# EAGLE design PCB (EAGLE 6.3)
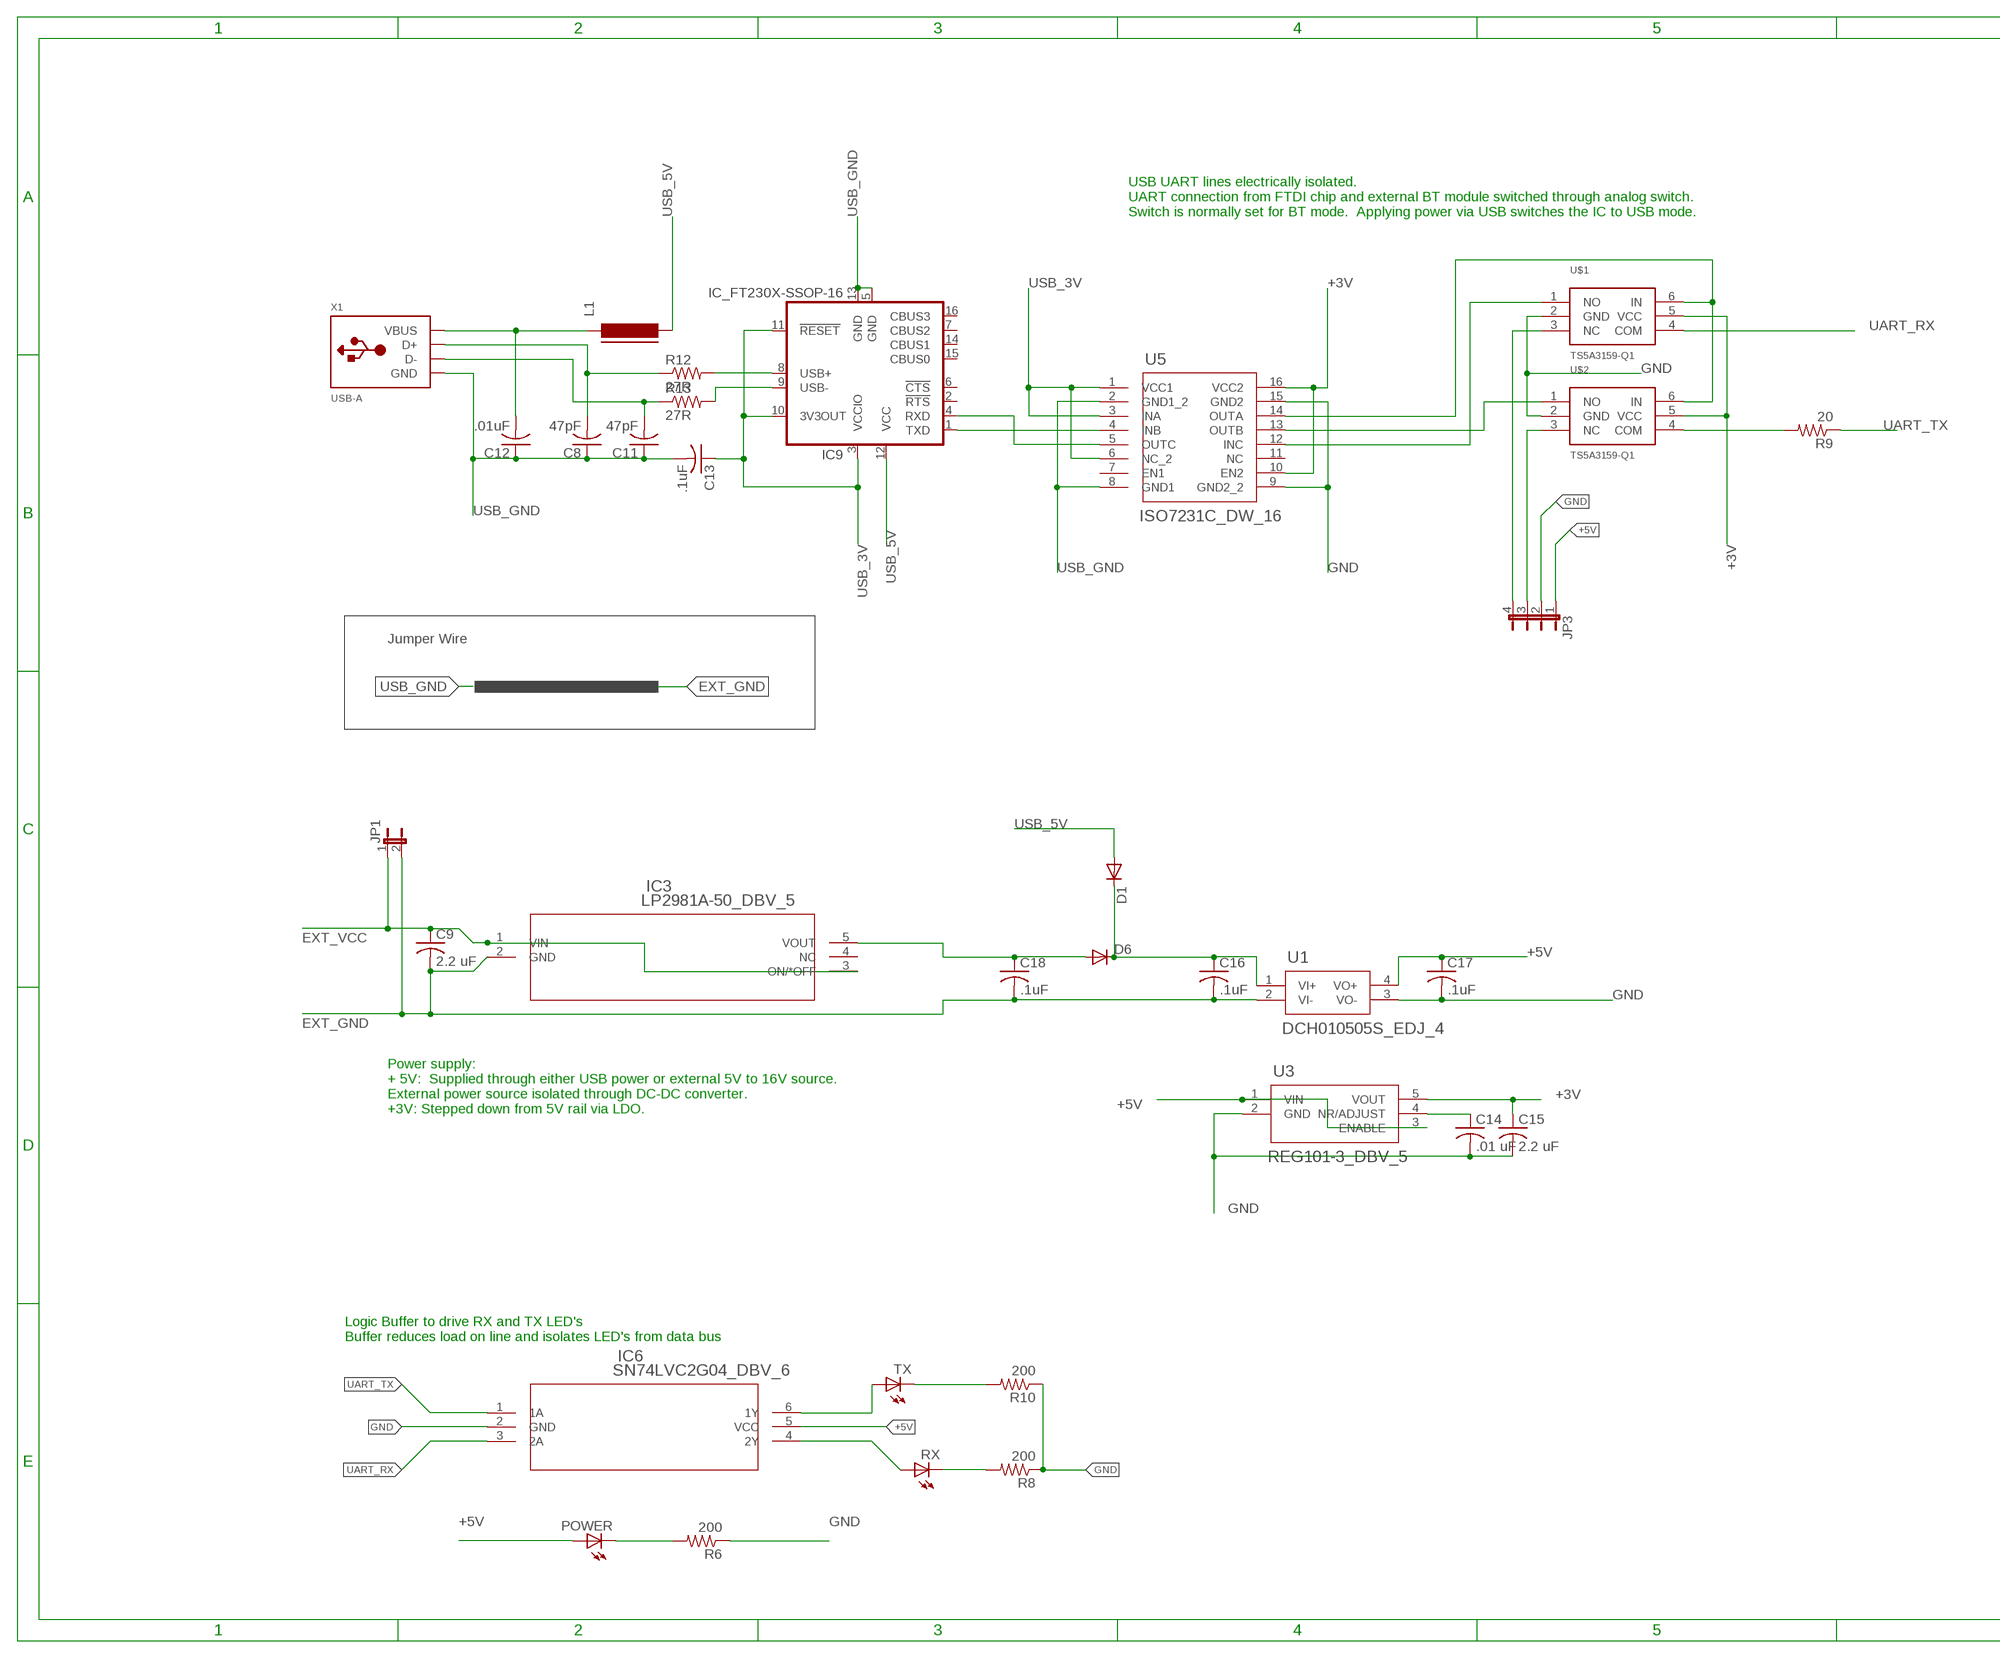
[diagram p0: schematic, sheet 1, part 1 of 2]
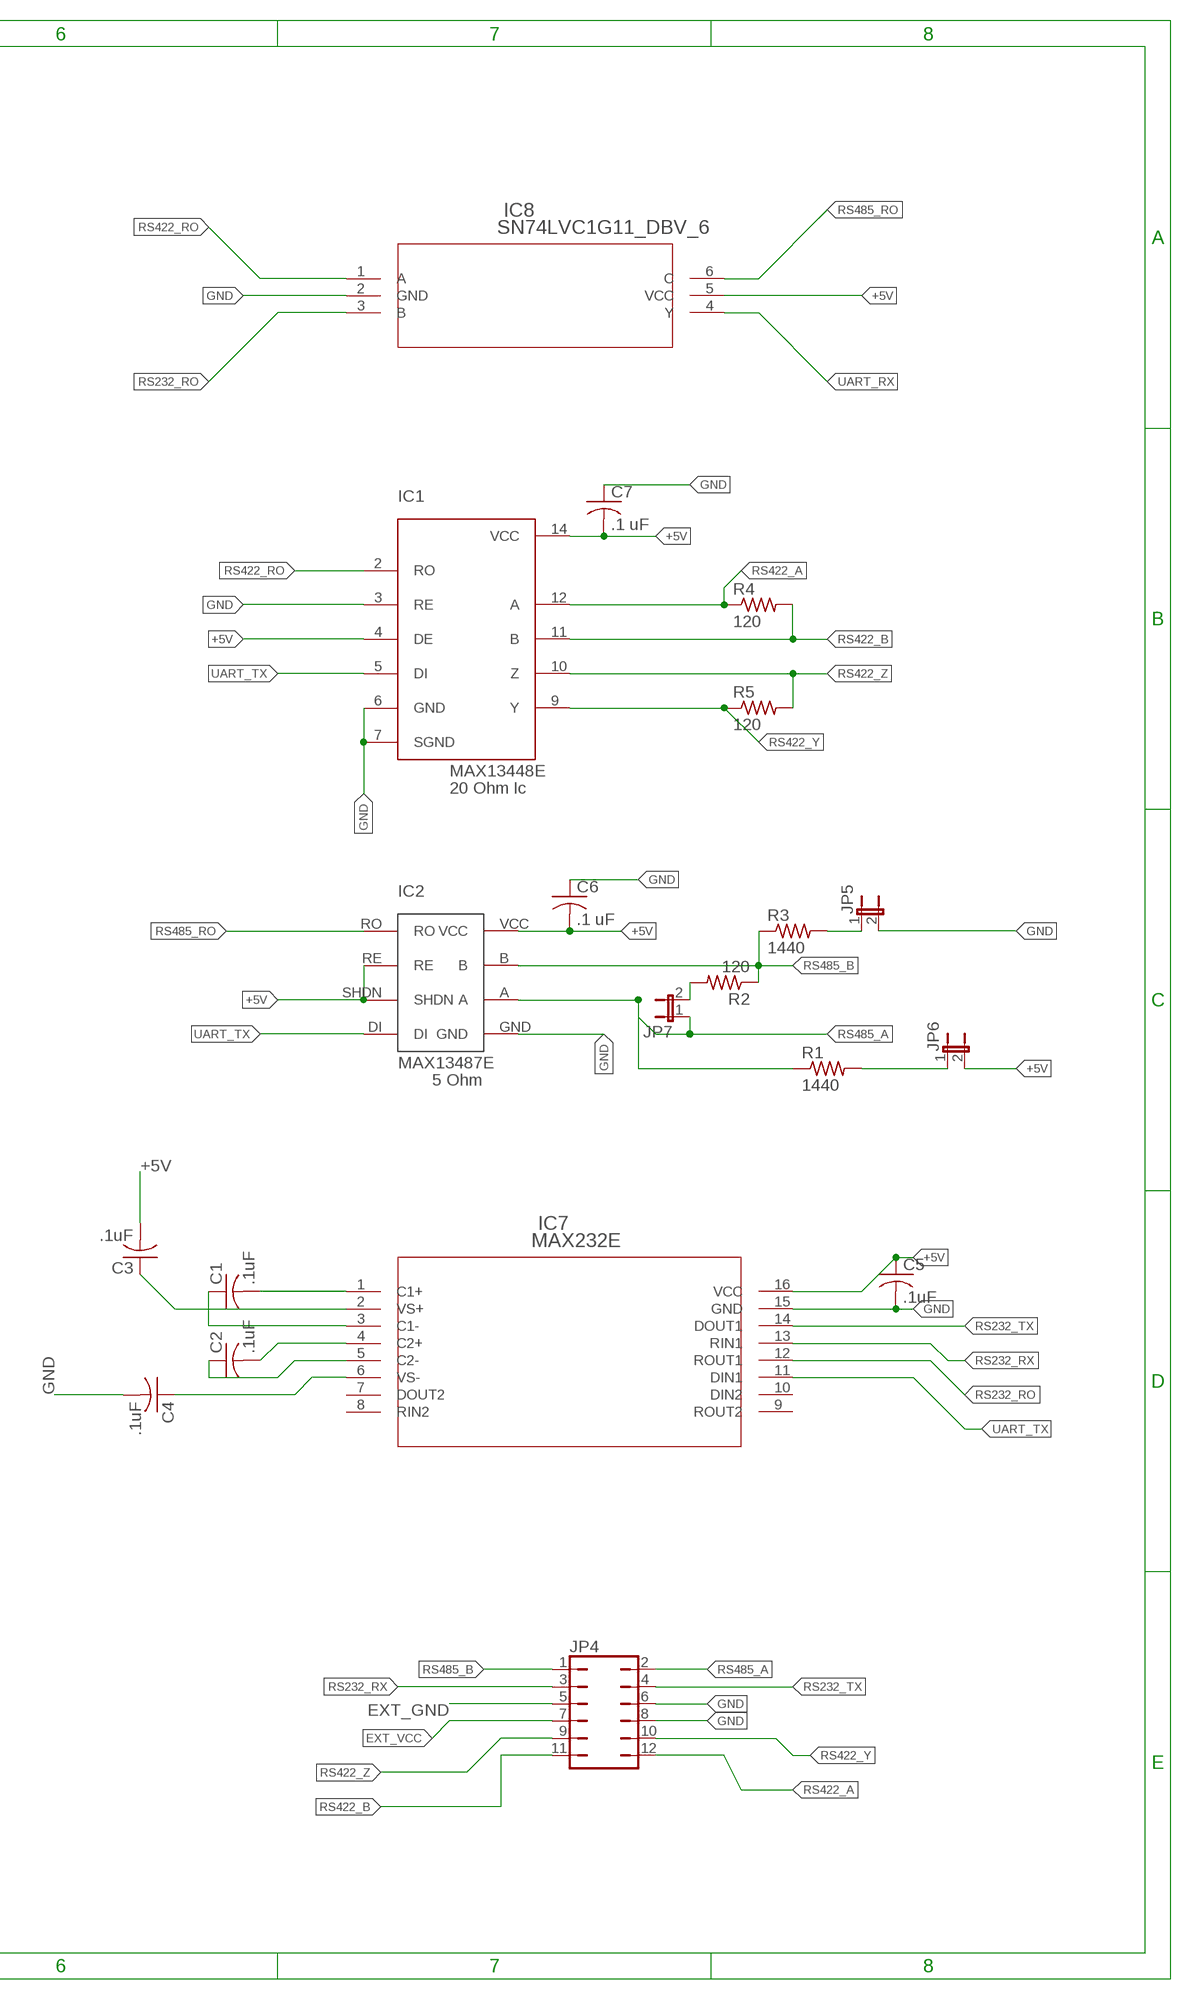
[diagram p1: schematic, sheet 1, part 2 of 2]

## Parts
C1  .1uF  C-USC1206  [C1206]
C2  .1uF  C-USC1206  [C1206]
C3  .1uF  C-USC1206  [C1206]
C4  .1uF  C-USC1206  [C1206]
C5  .1uF  C-USC1206  [C1206]
C6  .1 uF  C-USC1206  [C1206]
C7  .1 uF  C-USC1206  [C1206]
C8  47pF  C-USC1206  [C1206]
C9  2.2 uF  C-USC1206  [C1206]
C11  47pF  C-USC1206  [C1206]
C12  .01uF  C-USC1206  [C1206]
C13  .1uF  C-USC1206  [C1206]
C14  .01 uF  C-USC1206  [C1206]
C15  2.2 uF  C-USC1206  [C1206]
C16  .1uF  C-USC1206  [C1206]
C17  .1uF  C-USC1206  [C1206]
C18  .1uF  C-USC1206  [C1206]
D1  DIODE-SOT23  [SOT-23]
D6  DIODE-SOT23  [SOT-23]
IC1  MAX13448E  [SO14(N)]
IC2  MAX13487E  [MAX13487E]
IC3  LP2981A-50_DBV_5  [DBV5]
IC6  SN74LVC2G04_DBV_6  [DBV6]
IC7  MAX232E  MAX232E_D_16  [D16]
IC8  SN74LVC1G11_DBV_6  [DBV6]
IC9  IC_FT230X-SSOP-16  [SSOP-16-FTDI]
JP1  JP1E  [JP1]
JP3  JP4E  [JP4]
JP4  JP6Q  [JP6Q]
JP5  JP1E  [JP1]
JP6  JP1E  [JP1]
JP7  JP1E  [JP1]
L1  FERRITE-1206  [FB1206]
POWER  LEDSMT1206  [1206]
R1  1440  R-US_M1206  [M1206]
R2  120  R-US_M1206  [M1206]
R3  1440  R-US_M1206  [M1206]
R4  120  R-US_R1206  [R1206]
R5  120  R-US_R1206  [R1206]
R6  200  R-US_M1206  [M1206]
R8  200  R-US_M1206  [M1206]
R9  20  R-US_M1206  [M1206]
R10  200  R-US_M1206  [M1206]
R12  27R  R-US_R1206  [R1206]
R13  27R  R-US_R1206  [R1206]
RX  LEDSMT1206  [1206]
TX  LEDSMT1206  [1206]
U1  DCH010505S_EDJ_4  [EDJ4]
U3  REG101-3_DBV_5  [DBV5]
U5  ISO7231C_DW_16  [DW16]
U$1  TS5A3159-Q1  [DBV6]
U$2  TS5A3159-Q1  [DBV6]
X1  USB-A  [MOLEX_480371000]

## Nets
+3V: C15.1 U3.5(VOUT) U5.10(EN2) U5.16(VCC2) U$1.5(VCC) U$2.5(VCC)
+5V: C3.2 C5.1 C6.2 C7.2 C17.1 IC1.4(DE) IC1.14(VCC) IC2.RE IC2.SHDN IC2.VCC IC6.5(VCC) IC7.16(VCC) IC8.5(VCC) JP3.1 JP6.2 POWER.A U1.4(VO+) U3.1(VIN) U3.3(ENABLE)
BT_RX: JP3.4 U$1.3(NC)
BT_TX: JP3.3 U$2.3(NC)
EXT_5V: C18.1 D6.1(A) IC3.5(VOUT)
EXT_GND: C9.2 C16.2 C18.2 IC3.2(GND) JP1.2 JP4.5 U1.2(VI-)
EXT_VCC: C9.1 IC3.1(VIN) IC3.3(ON/*OFF) JP1.1 JP4.7
GND: C4.2 C5.2 C6.1 C7.1 C14.2 C15.2 C17.2 IC1.3(RE) IC1.6(GND) IC1.7(SGND) IC2.GND IC6.2(GND) IC7.15(GND) IC8.2(GND) JP3.2 JP4.6 JP4.8 JP5.2 R6.1 R8.1 R10.1 U1.3(VO-) U3.2(GND) U5.9(GND2_2) U5.15(GND2) U$1.2(GND) U$2.2(GND)
N$4: IC9.1(TXD) U5.4(INB)
N$5: IC9.4(RXD) U5.5(OUTC)
N$6: POWER.C R6.2
N$7: IC9.9(USB-) R13.2
N$8: IC9.8(USB+) R12.2
N$9: C8.2 R12.1 X1.3(D+)
N$10: C11.2 R13.1 X1.2(D-)
N$11: C14.1 U3.4(NR/ADJUST)
RS232_C1+: C1.2 IC7.1(C1+)
RS232_C1-: C1.1 IC7.3(C1-)
RS232_C2+: C2.2 IC7.4(C2+)
RS232_C2-: C2.1 IC7.5(C2-)
RS232_RO: IC7.12(ROUT1) IC8.3(B)
RS232_RX: IC7.13(RIN1) JP4.3
RS232_TX: IC7.14(DOUT1) JP4.4
RS232_VS+: C3.1 IC7.2(VS+)
RS232_VS-: C4.1 IC7.6(VS-)
RS422_A: IC1.12(A) JP4.12 R4.1
RS422_B: IC1.11(B) JP4.11 R4.2
RS422_RO: IC1.2(RO) IC8.1(A)
RS422_Y: IC1.9(Y) JP4.10 R5.1
RS422_Z: IC1.10(Z) JP4.9 R5.2
RS485_A: IC2.A JP4.2 JP7.1 R1.1
RS485_B: IC2.B JP4.1 R2.1 R3.1
RS485_BIASDOWN: JP5.1 R3.2
RS485_BIASUP: JP6.1 R1.2
RS485_RO: IC2.RO IC8.6(C)
RS485TERM: JP7.2 R2.2
RX_LED: IC6.4(2Y) RX.A
RX_LED2: R8.2 RX.C
TX_LED: IC6.6(1Y) TX.A
TX_LED2: R10.2 TX.C
UART_RX: IC6.3(2A) IC8.4(Y) U$1.4(COM)
UART_TX: IC1.5(DI) IC2.DI IC6.1(1A) IC7.11(DIN1) R9.1
UART_TX_1: R9.2 U$2.4(COM)
USB_3V: C13.1 IC9.3(VCCIO) IC9.10(3V3OUT) IC9.11(!RESET) U5.1(VCC1) U5.3(INA) U5.6(NC_2)
USB_5V: D1.1(A) IC9.12(VCC) L1.2
USB_GND: C8.1 C11.1 C12.1 C13.2 IC9.5(GND) IC9.13(GND) U5.2(GND1_2) U5.8(GND1) X1.4(GND)
USB_RX: U5.12(INC) U$1.1(NO)
USB_SWITCH: U5.14(OUTA) U$1.6(IN) U$2.6(IN)
USB_TX: U5.13(OUTB) U$2.1(NO)
USB_VCC: C16.1 D1.3(C) D6.3(C) U1.1(VI+)
VCC_USB: C12.2 L1.1 X1.1(VBUS)
Unconnected: IC3.4(NC) IC7.7(DOUT2) IC7.8(RIN2) IC7.9(ROUT2) IC7.10(DIN2) IC9.2(!RTS) IC9.6(!CTS) IC9.7(CBUS2) IC9.14(CBUS1) IC9.15(CBUS0) IC9.16(CBUS3) U5.7(EN1) U5.11(NC)

## Notes on the sheet
- USB UART lines electrically isolated.
  UART connection from FTDI chip and external BT module switched through analog switch. 
  Switch is normally set for BT mode.  Applying power via USB switches the IC to USB mode.
- Jumper Wire
- 20 Ohm Ic
- 5 Ohm
- Power supply:
  + 5V:  Supplied through either USB power or external 5V to 16V source.
  External power source isolated through DC-DC converter.
  +3V: Stepped down from 5V rail via LDO.
- Logic Buffer to drive RX and TX LED's
  Buffer reduces load on line and isolates LED's from data bus

## Library data of the parts
C1-C9 C11-C18 = adafruit:C-US: CAPACITOR, American symbol
D1 D6 = dp_devices:DIODE: Various Diode Packages
IC1 = maximIntegrated:MAX13448E
IC2 = maximIntegrated:MAX13487E
IC3 = TI:LP2981A-50_DBV_5; DATASHEETURL: http://www.ti.com/lit/gpn/LP2981A-50; DESCRIPTION: Single Output LDO, 100mA, Fixed(5.0V), Shutdown, 0.75% Tolerance; FAMILY_NAME: SINGLE CHANNEL LDO; GENERIC_PART_NUMBER: LP2981A-50; INDUSTRY_STD_PKG_TYPE: SOT-23; MANUFACTURER: Texas Instruments; MANUFACTURER_PART_NUMBER: lp2981a-50_dbv_5; PACKAGE_DESIGNATOR: DBV; PIN_COUNT: 5; VENDOR: Texas Instruments
IC6 = TI:SN74LVC2G04_DBV_6; DATASHEETURL: http://www.ti.com/lit/gpn/SN74LVC2G04; DESCRIPTION: Dual Inverter; FAMILY_NAME: LL INVERTER; GENERIC_PART_NUMBER: SN74LVC2G04; INDUSTRY_STD_PKG_TYPE: SOT-23; MANUFACTURER: Texas Instruments; MANUFACTURER_PART_NUMBER: sn74lvc2g04_dbv_6; PACKAGE_DESIGNATOR: DBV; PIN_COUNT: 6; VENDOR: Texas Instruments
IC7 = TI:MAX232E_D_16; DATASHEETURL: http://www.ti.com/lit/gpn/MAX232E; DESCRIPTION: Dual RS-232 Driver/Receiver with IEC61000-4-2 Protection; FAMILY_NAME: RS-232; GENERIC_PART_NUMBER: MAX232E; INDUSTRY_STD_PKG_TYPE: SOIC; MANUFACTURER: Texas Instruments; MANUFACTURER_PART_NUMBER: max232e_d_16; PACKAGE_DESIGNATOR: D; PIN_COUNT: 16; VENDOR: Texas Instruments
IC8 = TI:SN74LVC1G11_DBV_6; DATASHEETURL: http://www.ti.com/lit/gpn/SN74LVC1G11; DESCRIPTION: Single 3-Input Positive-AND Gate; FAMILY_NAME: LL AND GATE; GENERIC_PART_NUMBER: SN74LVC1G11; INDUSTRY_STD_PKG_TYPE: SOT-23; MANUFACTURER: Texas Instruments; MANUFACTURER_PART_NUMBER: sn74lvc1g11_dbv_6; PACKAGE_DESIGNATOR: DBV; PIN_COUNT: 6; VENDOR: Texas Instruments
IC9 = dp_devices:IC_FT230X: BASIC USB to UART IC
JP1 JP5-JP7 = jumper:JP1E: JUMPER
JP3 = jumper:JP4E: JUMPER
JP4 = jumper:JP6Q: JUMPER
L1 = dp_devices:FERRITE: Ferrite bead in various packages
POWER RX TX = adafruit:LED: LED OSRAM: - CHIPLED LG R971, LG N971, LY N971, LG Q971, LY Q971, LO R971, LY R971 LH N974, LH R974 LS Q976, LO Q976, LY Q976 LO Q996 - Hyper CHIPLED LW Q18S LB Q993, LB Q99A, LB R99A - SideLED LS A670, LO A670, LY A670, LG A670, LP A670 LB A673, LV A673, LT A673, LW A673 LH A674 LY A675 LS A676, LA A676, LO A676, LY A676, LW A676 LS A679, LY A679, LG A679 - Hyper Micro SIDELED® LS Y876, LA Y876, LO Y876, LY Y876 LT Y87S - SmartLED LW L88C, LW L88S LB L89C, LB L89S, LG L890 LS L89K, LO L89K, LY L89K LS L896, LA L896, LO L896, LY L896 - TOPLED LS T670, LO T670, LY T670, LG T670, LP T670 LSG T670, LSP T670, LSY T670, LOP T670, LYG T670 LG T671, LOG T671, LSG T671 LB T673, LV T673, LT T673, LW T673 LH T674 LS T676, LA T676, LO T676, LY T676, LB T676, LH T676, LSB T676, LW T676 LB T67C, LV T67C, LT T67C, LS T67K, LO T67K, LY T67K, LW E67C LS E67B, LA E67B, LO E67B, LY E67B, LB E67C, LV E67C, LT E67C LW T67C LS T679, LY T679, LG T679 LS T770, LO T770, LY T770, LG T770, LP T770 LB T773, LV T773, LT T773, LW T773 LH T774 LS E675, LA E675, LY E675, LS T675 LS T776, LA T776, LO T776, LY T776, LB T776 LHGB T686 LT T68C, LB T68C - Hyper Mini TOPLED® LB M676 - Mini TOPLED Santana® LG M470 LS M47K, LO M47K, LY M47K Source: http://www.osram.convergy.de/
R1-R6 R8-R10 R12 R13 = adafruit:R-US_: RESISTOR, American symbol
U1 = TI:DCH010505S_EDJ_4; DATASHEETURL: http://www.ti.com/lit/gpn/DCH010505S; DESCRIPTION: Miniature, 1W, 3kVDC Isolated DC/DC Converters; FAMILY_NAME: 1 W AND 2 W MINIATURE; GENERIC_PART_NUMBER: DCH010505S; INDUSTRY_STD_PKG_TYPE: SIP MODULE; MANUFACTURER: Texas Instruments; MANUFACTURER_PART_NUMBER: dch010505s_edj_4; PACKAGE_DESIGNATOR: EDJ; PIN_COUNT: 4; VENDOR: Texas Instruments
U3 = TI:REG101-3_DBV_5; DATASHEETURL: http://www.ti.com/lit/gpn/REG101-3; DESCRIPTION: Single Output LDO, 100mA, Fixed(3.0V), Low Noise, Fast Transient Response; FAMILY_NAME: SINGLE CHANNEL LDO; GENERIC_PART_NUMBER: REG101-3; INDUSTRY_STD_PKG_TYPE: SOT-23; MANUFACTURER: Texas Instruments; MANUFACTURER_PART_NUMBER: reg101-3_dbv_5; PACKAGE_DESIGNATOR: DBV; PIN_COUNT: 5; VENDOR: Texas Instruments
U5 = TI:ISO7231C_DW_16; DATASHEETURL: http://www.ti.com/lit/gpn/ISO7231C; DESCRIPTION: Triple Channel, 2/1, 25Mbps, Digital Isolator; FAMILY_NAME: ISOLATOR; GENERIC_PART_NUMBER: ISO7231C; INDUSTRY_STD_PKG_TYPE: SOIC; MANUFACTURER: Texas Instruments; MANUFACTURER_PART_NUMBER: iso7231c_dw_16; PACKAGE_DESIGNATOR: DW; PIN_COUNT: 16; VENDOR: Texas Instruments
U$1 U$2 = TI:TS5A3159-Q1
X1 = adafruit:USB-A: USB type A 'plug' Used for things that can directly connect to a USB port, say USB key

## Board
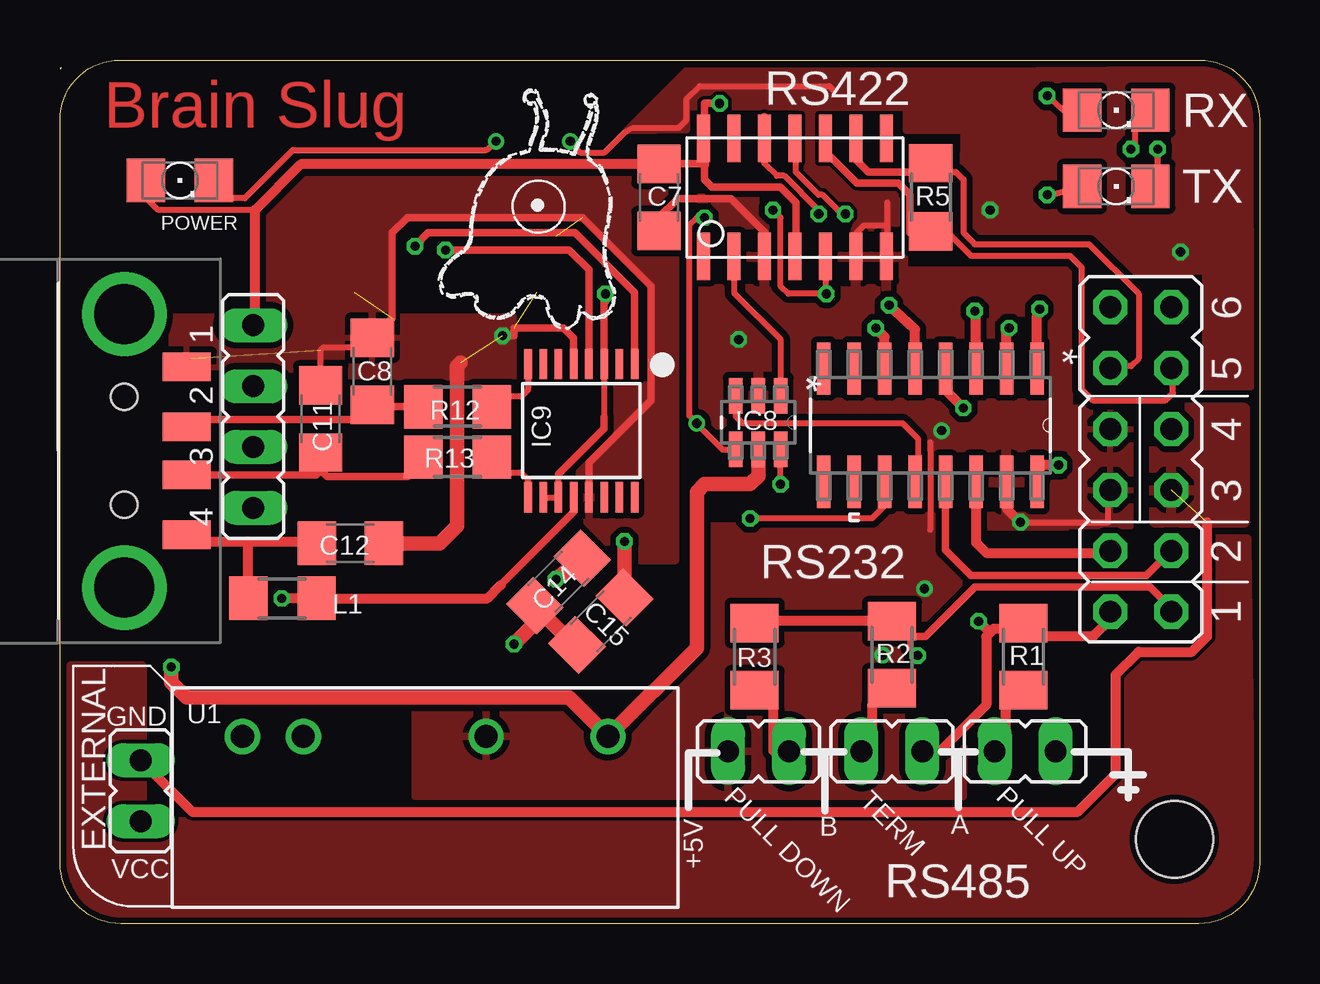
[diagram p2: board, top side]
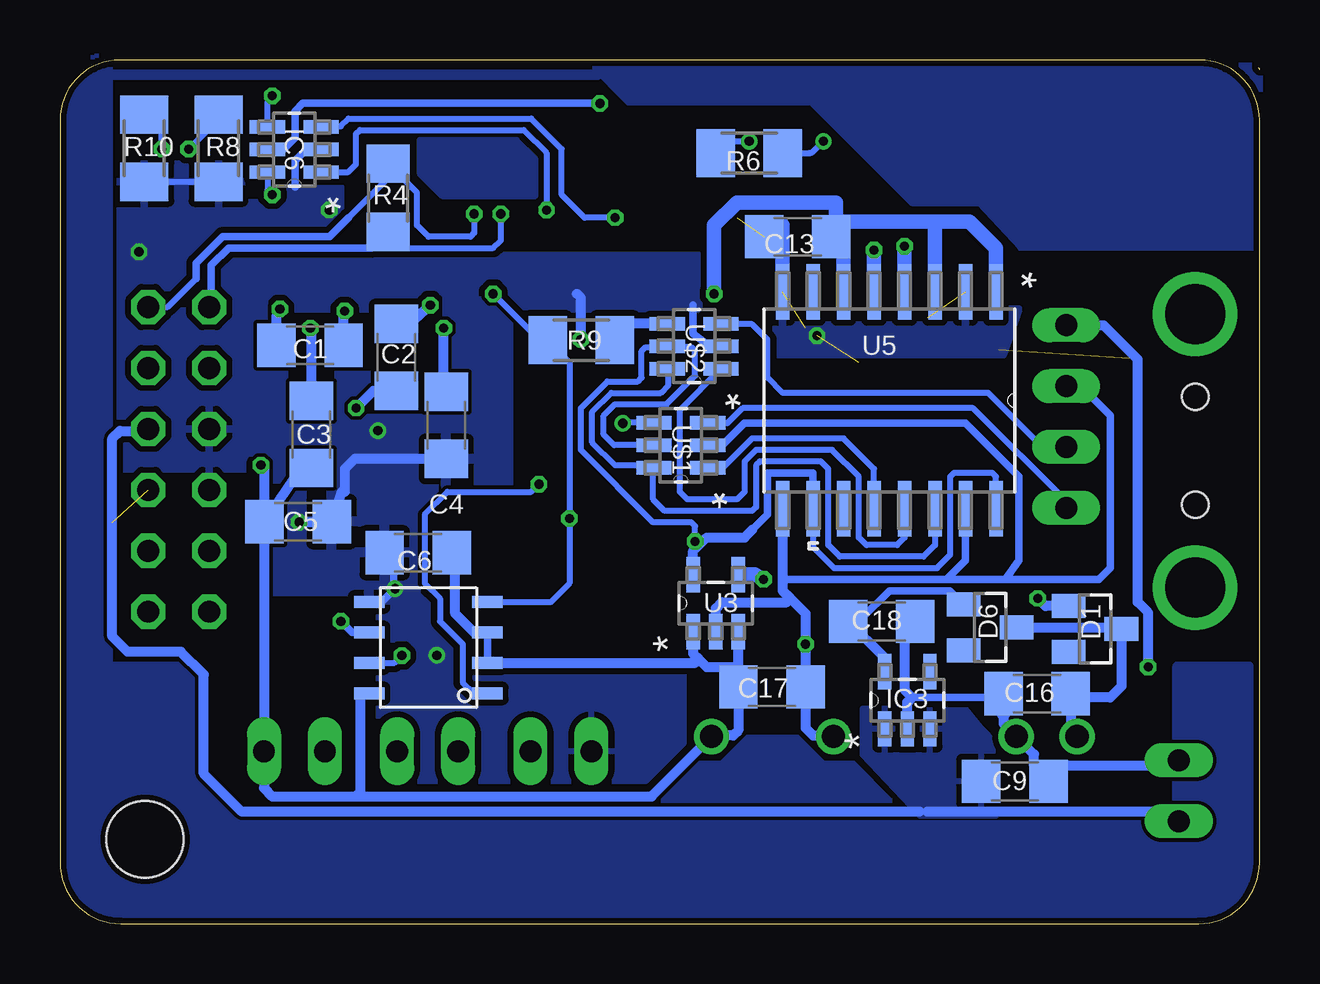
[diagram p3: board, bottom side, seen from below]

Size 50 x 36.01 mm. Coordinates in mm from the lower left corner, seen from the top.
Outline: 0.06,35.68 arc90 0,35.62
Outline: 2.5,36.01 47.5,36.01 arc-90 50,33.51 50,2.54 arc-90 47.46,0 2.54,0 arc-90 0,2.54 0,33.51 arc-90 2.5,36.01
Copper layers (1*16): Top 0.035mm / dielectric 1.5mm / Bottom 0.035mm
Design rules "Fusion_eagle_rule_v1.1 *": minimum track width 6mil, minimum drill 12mil, track to track 6mil, track to pad 6mil, pad to pad 6mil, via to via 6mil, smd to smd 0mil, copper to edge 10mil, drill to drill 10mil, minimum pad ring 10mil, minimum via ring 6mil, stop-mask expansion 2mil, vias tented up to drill 24mil, thermal gap 10mil
Holes 3.2 mm at 46.46,3.51

### Footprints (pad centres in the part's own frame; a part is rotated, then mirrored left to right if it is on the bottom)
C1206 = smd 1.6 x 1.8: 1 -1.4,0; 2 1.4,0
SOT-23 = smd 1 x 1.4: 1 -0.95,-1.1; 2 0.95,-1.1; 3 0,1.1
SO14(N) = smd 1.981 x 0.553: 1 -2.464,3.81; 2 -2.464,2.54; 3 -2.464,1.27; 4 -2.464,0; 5 -2.464,-1.27; 6 -2.464,-2.54; 7 -2.464,-3.81; 8 2.464,-3.81; 9 2.464,-2.54; 10 2.464,-1.27; 11 2.464,0; 12 2.464,1.27; 13 2.464,2.54; 14 2.464,3.81
MAX13487E = smd 0.49 x 1.27: A 0.635,2.465; B -0.635,2.465; DI 1.905,-2.465; GND 1.905,2.465; RE -0.635,-2.465; RO -1.905,-2.465; SHDN 0.635,-2.465; VCC -1.905,2.465
DBV5 = smd 1.473 x 0.559: 1 -1.194,0.94; 2 -1.194,0; 3 -1.194,-0.94; 4 1.194,-0.94; 5 1.194,0.94
DBV6 = smd 1.473 x 0.559: 1 -1.118,0.94; 2 -1.118,0; 3 -1.118,-0.94; 4 1.118,-0.94; 5 1.118,0; 6 1.118,0.94
D16 = smd 2.184 x 0.559: 1 -2.362,4.445; 2 -2.362,3.175; 3 -2.362,1.905; 4 -2.362,0.635; 5 -2.362,-0.635; 6 -2.362,-1.905; 7 -2.362,-3.175; 8 -2.362,-4.445; 9 2.362,-4.445; 10 2.362,-3.175; 11 2.362,-1.905; 12 2.362,-0.635; 13 2.362,0.635; 14 2.362,1.905; 15 2.362,3.175; 16 2.362,4.445
SSOP-16-FTDI = smd 0.32 x 1.26: 1 -2.223,-2.779; 2 -1.588,-2.779; 3 -0.953,-2.779; 4 -0.318,-2.779; 5 0.317,-2.779; 6 0.952,-2.779; 7 1.587,-2.779; 8 2.222,-2.779; 9 2.222,2.779; 10 1.587,2.779; 11 0.952,2.779; 12 0.317,2.779; 13 -0.318,2.779; 14 -0.953,2.779; 15 -1.588,2.779; 16 -2.223,2.779
JP1 = drill 0.914 long: 1 0,-1.27; 2 0,1.27
JP4 = drill 0.914 long: 1 -3.81,0; 2 -1.27,0; 3 1.27,0; 4 3.81,0
JP6Q = drill 0.914 octagon: 1 -6.35,-1.27; 2 -6.35,1.27; 3 -3.81,-1.27; 4 -3.81,1.27; 5 -1.27,-1.27; 6 -1.27,1.27; 7 1.27,-1.27; 8 1.27,1.27; 9 3.81,-1.27; 10 3.81,1.27; 11 6.35,-1.27; 12 6.35,1.27
FB1206 = smd 1.6 x 1.803: 1 -1.422,0; 2 1.422,0
1206 = smd 1.6 x 1.803: A -1.422,0; C 1.422,0
M1206 = smd 1.6 x 2: 1 -1.4,0; 2 1.4,0
R1206 = smd 1.6 x 1.803: 1 -1.422,0; 2 1.422,0
EDJ4 = drill 0.965: 1 -15.24,5.08; 2 -12.7,5.08; 3 -5.08,5.08; 4 0,5.08
DW16 = smd 2.311 x 0.559: 1 -4.521,4.445; 2 -4.521,3.175; 3 -4.521,1.905; 4 -4.521,0.635; 5 -4.521,-0.635; 6 -4.521,-1.905; 7 -4.521,-3.175; 8 -4.521,-4.445; 9 4.521,-4.445; 10 4.521,-3.175; 11 4.521,-1.905; 12 4.521,-0.635; 13 4.521,0.635; 14 4.521,1.905; 15 4.521,3.175; 16 4.521,4.445
MOLEX_480371000 = smd 1.2 x 2: 1 3.5,2.6; 2 1,2.6; 3 -1,2.6; 4 -3.5,2.6 | drill 2.5: M1 -5.7,0; M2 5.7,0 | hole 1.1: -2.25,0; 2.25,0

### Placement (x,y rotation side)
C1  39.58,24.11 180 bottom
C2  35.98,23.61 270 bottom
C3  39.52,20.4 270 bottom
C4  33.9,20.78 270 bottom
C5  40.07,16.76 0 bottom
C6  35.07,15.47 0 bottom
C7  24.97,30.28 90 top
C8  13.02,23.03 270 top
C9  10.2,5.94 0 bottom
C11  10.86,21.05 270 top
C12  12.1,15.86 180 top
C13  19.25,28.64 180 bottom
C14  20.78,14.25 225 top
C15  22.54,12.62 225 top
C16  9.27,9.59 180 bottom
C17  20.32,9.88 0 bottom
C18  15.75,12.61 0 bottom
D1  6.86,12.29 270 bottom
D6  11.23,12.36 270 bottom
IC1  30.63,30.28 90 top
IC2  34.64,11.51 90 bottom
IC3  14.68,9.32 90 bottom
IC6  40.23,32.27 180 bottom
IC7  36.28,20.78 270 top
IC8  29.1,20.9 270 top
IC9  21.73,20.56 180 top
JP1  3.37,5.54 0 top
JP3  8.06,21.15 270 top
JP4  45.05,19.36 90 top
JP5  29.12,7.19 90 top
JP6  40.23,7.19 270 top
JP7  34.67,7.19 90 top
L1  9.27,13.57 0 top
POWER  5,30.99 0 top
R1  40.15,11.14 270 top
R2  34.68,11.22 270 top
R3  28.96,11.14 270 top
R4  36.32,30.26 90 bottom
R5  36.3,30.29 270 top
R6  21.27,32.13 0 bottom
R8  43.39,32.33 90 bottom
R9  28.27,24.32 0 bottom
R10  46.49,32.33 90 bottom
R12  16.57,21.56 0 top
R13  16.57,19.46 0 top
RX  44.03,33.91 0 top
TX  44.03,30.74 0 top
U1  22.84,2.73 0 top
U3  22.66,13.36 90 bottom
U5  15.43,21.82 270 bottom
U$1  24.12,19.95 180 bottom
U$2  23.57,24.08 180 bottom
X1  2.68,19.71 270 top

### Tracks (layer width: path | path; a pad name or v marks a point on that pad's centre or on a via)
+3V  (via drill 0.38)
  Top 0.61: v23.53,15.94 C15.1
  Bottom 0.254: U5.10 18.61,15.71 17.73,14.83 13.45,14.83 12.89,15.39 12.89,18.64 12.73,18.8 11.15,18.8 10.99,18.64 U5.16 | U$1.5 26.9,19.95 27.34,20.39 27.34,21.18 26.86,21.66 24.72,21.66 23.53,22.85 23.53,23.88 23.69,24.04 24.65,24.04 U$2.5 24.72,24.04 25.59,24.04 25.75,23.88 25.75,22.77 25.91,22.61 27.18,22.61 28.29,21.5 28.29,19.75 25.27,16.74 23.69,16.74 23.53,16.58 v23.53,15.94
  Bottom 0.305: v23.53,15.94 23.37,15.78 | U5.10 18.61,18.8 20.51,18.8 20.51,17.05 21.15,16.42
  Bottom 0.406: U3.5 23.6,15.55 23.37,15.78 23.05,16.1 21.46,16.1 21.15,16.42
+5V  (via drill 0.38)
  Top 0.1: 8.13,24.99 arc45 JP3.1
  Top 0.254: POWER.A 3.58,30.28 4.1,29.75 8.13,29.75
  Top 0.305: 26.86,31.98 26.86,31.66 26.86,31.02 27.18,30.71 30.04,30.71 30.67,30.07 30.67,27.85 | C7.2 26.84,31.68 | v27.5,34.2 26.86,34.2 26.86,33.56
  Top 0.406: v41.63,19.12 40.99,19.12 40.83,18.96 40.83,18.53 IC7.16 | 26.86,31.98 26.82,32.01 IC1.14 26.82,33.53 26.86,33.56 | 30.67,27.85 IC1.4 | 26.84,31.68 26.86,31.66 | 8.13,24.99 8.13,29.75 10.03,31.66 24.64,31.66 24.66,31.68 C7.2
  Top 0.61: v4.64,10.7 4.64,10.07 5.27,9.43 21.21,9.43 U1.4 26.54,11.51 26.54,18.01 26.86,18.32 28.77,18.32 29.1,18.66 IC8.5
  Bottom 0.1: JP6.2 arc-45 41.48,7.2 41.47,7.21
  Bottom 0.305: IC2.SHDN IC2.RE | 33.69,15.73 33.69,15.76 C6.2 | IC6.5 40.69,32.27 40.2,32.77 40.2,33.88 39.88,34.2 v27.5,34.2
  Bottom 0.406: U1.4 22.8,7.85 21.94,7.85 21.72,8.07 C17.1 21.72,10.7 | U1.4 | 21.72,10.7 U3.3 | U3.1 23.6,11.26 23.37,11.02 | 23.37,11.02 23.05,10.7 21.72,10.7 | JP3.1 6.51,24.96 5.08,23.53 5.08,13.41 4.64,12.97 v4.64,10.7 | C3.2 39.67,19.39 C5.1 | C5.1 41.47,18.96 v41.63,19.12 | IC2.RE 23.51,10.88 23.37,11.02 | JP6.2 41.5,5.66 41.15,5.31 37.66,5.31 | 37.66,5.31 25.34,5.31 U1.4 | IC2.VCC 37.48,9.61 37.5,9.59 37.5,5.47 37.66,5.31 | IC2.SHDN 32.75,12.15 33.53,12.93 33.53,15.33 C6.2 | 41.47,7.21 41.47,17.59 C5.1
BT_RX
  Bottom 0.254: JP3.4 8.06,17.62 11.94,21.5 21.54,21.5 22.18,20.86 22.98,20.86 U$1.3
BT_TX
  Bottom 0.254: JP3.3 9.05,19.88 11.3,22.13 19.88,22.13 20.51,22.77 20.51,24.36 21.15,24.99 22.42,24.99 U$2.3
EXT_5V
  Bottom 0.305: 16.57,12.74 15.43,13.88 12.9,13.88 D6.1
  Bottom 0.406: D6.1 12.39,13.24 12.39,13.37 | IC3.5 15.62,11.08 C18.1 17.02,12.74 16.57,12.74
EXT_GND  (1 unrouted)
  Top 0.406: 47.82,16.74 47.82,11.97 47.18,11.34 44.96,11.34 44.01,10.39 44.01,6.26 42.42,4.67 5.51,4.67 JP1.2
  Bottom 0.305: 14.48,9.43 11.31,9.43
  Bottom 0.406: C16.2 10.67,8.8 10.67,8.34 U1.2 9.4,7.06 9.4,6.58 9.08,6.58 | IC3.2 14.68,9.24 14.48,9.43 14.8,9.75 14.8,12.29 14.48,12.61 C18.2 | 11.31,9.43 10.87,9 | 9.08,6.58 3.6,6.58 JP1.2 | C9.2 8.8,6.29 9.08,6.58
  Bottom 0.61: 10.87,9 10.67,8.8
  pour Top (isolate 0.254): 45.59,21.5 45.59,16.74 49.4,16.74 49.4,21.5
EXT_VCC
  Bottom 0.406: 13.84,4.67 3.76,4.67 JP1.1 | 14.16,4.67 42.42,4.67 44.01,6.26 44.01,10.39 44.96,11.34 47.18,11.34 47.82,11.97 47.82,20.23 47.5,20.55 46.4,20.55 JP4.7
  pour Bottom (isolate 0.254): 16.54,8.96 16.54,7.05 14.16,4.51 10.99,4.51 10.99,7.53 11.62,8.16 12.26,8.96
GND  (via drill 0.38)
  Top 0.254: v40.04,16.74 43.69,16.74 43.69,18 JP4.6 | 33.21,27.85 33.21,28.8 33.53,29.12 34.48,29.12 | 34.48,27.85 34.48,29.12 | 34.48,29.12 34.48,30.07 | v21.27,32.62 arc45 21.33,32.49 21.67,32.15 22.7,32.15 23.57,33.02 23.89,33.18 25.8,33.18 26.11,33.5 26.11,34.37 26.67,34.92 32.07,34.92 32.23,34.77 | 36.27,20.08 36.27,16.43
  Top 0.305: 34.5,27.87 IC1.7 | IC1.3 29.36,28.84 27.97,30.23 25.75,30.23 24.96,29.44 24.96,28.89 C7.1
  Top 0.406: IC7.15 39.45,17.32 v40.04,16.74 | 33.23,27.87 IC1.6 | C7.1 25.67,28.88
  Top 0.61: C15.2 21.42,11.63 C14.2 19.79,12.52 v18.92,11.66
  Bottom 0.1: 22.42,24.04 arc-45 22.42,24.05 U$2.2
  Bottom 0.254: R10.1 R8.1 | R6.1 22.67,32.31 arc45 22.6,32.49 22.46,32.62 v21.27,32.62
  Bottom 0.305: IC2.GND 36.58,13.42 36.09,13.91 36.09,15.4 C6.1 36.41,15.53 | U5.15 12.26,15.15 13.05,14.36 | 13.05,14.36 19.88,14.36 | U$1.2 22.38,19.95 21.46,20.86 12.26,20.86 10.03,18.64 10.03,15.15 10.59,14.36 | 10.59,14.36 13.05,14.36 | JP3.2 7.46,22.42 6.22,21.18 6.22,14.83 6.7,14.36 10.59,14.36 | 22.42,24.04 22.89,24.04 23.61,24.59 23.61,25.79 | IC6.2 39.74,32.27 40.2,31.82 40.2,30.71
  Bottom 0.406: U1.3 17.8,7.85 18.61,7.85 18.92,8.16 C17.2 v18.92,11.66 18.92,12.93 19.56,13.56 | U5.9 19.88,14.36 19.88,13.88 19.56,13.56 | U3.2 22.66,13.16 22.42,13.4 19.72,13.4 19.56,13.56 | C4.2 37.71,19.38 38.13,18.96 38.13,18.01 38.26,18.01 C5.2 38.67,16.99 38.93,16.74 v40.04,16.74 | v28.29,24.36 28.29,26.1 28.45,26.26
  other vias: 38.77,29.75 46.71,28.01 36.75,20.56 36.04,13.97 34.29,11.19
  pour Bottom: 42.1,13.88 31.31,13.88 31.31,25.94 42.1,25.94
  pour Top (isolate 0.254): 41.94,16.58 26.64,16.58 26.79,32.93 35.43,32.93 35.12,27.21 42.1,27.21
  pour Bottom (isolate 0.254): 24,10.39 24,7.53 25.59,5.94 36.7,5.94 36.7,16.1 33.53,16.1 33.53,10.39
  pour Bottom (isolate 0.254): 23.37,25.63 42.1,25.63 42.1,27.85 23.37,27.85
  pour Top (isolate 0.254): 42.1,16.58 44.64,16.58 44.64,21.5 42.1,21.5
  pour Bottom (isolate 0.254): 38.29,30.71 38.29,29.75 38.93,29.12 43.37,29.12 45.28,27.21 47.5,27.21 47.5,31.66 42.42,31.66 42.42,30.07 40.83,30.07 40.83,30.71
  pour Top (isolate 0.254): 49.64,22.39 47.76,22.4 47.76,27.21 44.32,27.21 43.05,28.8 38.29,28.8 38.13,28.96 38.13,31.18 37.66,31.66 37.74,35.55 49.56,35.63
  pour Top: 32.58,28.8 34.8,28.8 34.8,30.39 33.21,30.39 31.62,31.98 31.62,34.04 35.28,34.04 35.28,33.09 37.66,33.09 37.66,35.55 26.09,35.55 23.61,33.07 26.11,33.1 26.11,34.05 30.96,34.05 30.99,31.34
  pour Top (isolate 0.254): 14.8,8.8 20.83,8.8 22.42,7.21 23.37,7.21 27.18,11.34 27.18,16.58 37.66,16.58 37.66,5.3 14.8,5.3
  pour Bottom (isolate 0.254): 42.1,27.85 47.5,27.85 47.5,18.96 42.1,18.96
N$2
  pour Bottom: 0.47,10.73 0.47,2.7 arc90 3.01,0.16 47.09,0.16 arc90 49.63,2.7 49.63,10.73 44.03,10.73 44.03,6.22 43.87,6.22 42.32,4.67 3.42,4.67 3.42,10.73
  pour Top (no thermals): 0.47,10.73 0.47,2.7 arc90 3.01,0.16 47.09,0.16 arc90 49.63,2.7 49.47,16.02 48.23,16.02 48.23,12.13 47.14,11.36 45.12,11.36 44.03,10.42 44.03,6.22 43.87,6.22 42.32,4.67 3.42,4.67 3.42,10.73
N$3
  pour Bottom: 0,28.16 9.96,28.16 11.67,30.03 14.47,30.03 18.67,34.23 26.29,34.23 27.85,35.78 0,35.78
N$4  (via drill 0.38)
  Top 0.305: IC9.1 23.95,26.31 21.46,28.8 15.35,28.8 v14.8,28.25
  Bottom 0.61: U5.4 v14.8,28.25
N$5  (via drill 0.38)
  Top 0.305: IC9.4 22.05,27.27 21.23,28.09 v16.07,28.09
  Bottom 0.61: U5.5 v16.07,28.09
N$6  (via drill 0.38)
  Top 0.254: v18.18,32.62 17.88,32.32 arc-45 17.7,32.25 9.71,32.25 7.7,30.24 6.91,30.24 6.91,30.5 POWER.C
  Bottom 0.254: R6.2 18.78,32.13 arc-45 18.6,32.2 v18.18,32.62
N$7
  Top 0.254: IC9.9 19.51,18.54 19.24,18.8 18.65,18.8 R13.2
N$8
  Top 0.254: IC9.8 19.51,22.24 19.24,21.98 18.21,21.98 17.99,21.76 R12.2
N$9
  Top 0.305: 5.27,21.02 12.89,21.02 13.02,21.15 C8.2 13.09,21.56 R12.1
  Top 0.406: X1.3 4.96,20.71 5.27,21.02
N$10
  Top 0.305: X1.2 10.67,18.71 10.86,18.91 | C11.2 10.86,18.91 | 15.15,19.31 R13.1 14.48,18.79 14.48,18.64 11.13,18.64 10.86,18.91
N$11  (via drill 0.38)
  Top 0.61: C14.1 21.71,15.24 v20.67,14.36
  Bottom 0.61: U3.4 21.03,14.56 v20.67,14.36
N$12
  pour Bottom: 15.4,5.13 24.89,5.13 23.34,6.69 22.4,6.69 21.31,7.78 19.29,7.78 18.2,6.69 16.96,6.69
N$13
  pour Bottom: 30.18,30.34 30.18,31.89 30.96,32.67 35,32.67 35,31.27 34.07,30.34
N$14
  pour Bottom: 49.94,10.89 49.94,34.23 arc90 47.92,36.25 47.92,10.89
N$15
  pour Bottom: 27.54,35.47 47.92,35.47 47.92,35.32 27.54,35.32
RS232_C1+  (via drill 0.38)
  Top 0.406: IC7.1 40.72,25.36 v40.83,25.63
  Bottom 0.406: C1.2 40.98,25.32 v40.83,25.63
RS232_C1-  (via drill 0.38)
  Top 0.406: IC7.3 38.18,25.42 v38.13,25.55
  Bottom 0.406: C1.1 38.18,25.43 v38.13,25.55
RS232_C2+  (via drill 0.38)
  Top 0.406: IC7.4 36.91,22.24 v37.66,21.5
  Bottom 0.406: C2.2 36.94,22.21 v37.66,21.5
RS232_C2-  (via drill 0.38)
  Top 0.406: IC7.5 35.64,24.78 v34.56,25.79
  Bottom 0.406: C2.1 35.41,25.01 v34.56,25.79
RS232_RO
  Top 0.254: IC8.3 28.16,21.15 28.45,20.86 35.12,20.86 35.75,20.23 35.75,18.53 IC7.12
RS232_RX
  Top 0.305: IC7.13 36.91,15.57 37.97,14.51 45.28,14.51 JP4.3
RS232_TX
  Top 0.406: IC7.14 38.18,15.89 38.61,15.47 43.69,15.47 JP4.4
RS232_VS+  (via drill 0.38)
  Top 0.406: IC7.2 39.45,24.73 v39.56,24.83
  Bottom 0.406: C3.1 39.52,24.79 v39.56,24.83
RS232_VS-  (via drill 0.38)
  Top 0.406: IC7.6 34.37,24.46 v34.01,24.83
  Bottom 0.406: C4.1 34.15,22.63 34.01,22.77 v34.01,24.83
RS422_A  (via drill 0.38)
  Top 0.254: IC1.12 29.36,31.7 29.88,31.18 30.2,31.18 31.62,29.75 v31.62,29.6
  Top 0.406: IC1.12 29.36,33.6
  Bottom 0.254: v31.62,29.6 31.62,28.48 31.94,28.17 36.07,28.17 36.32,28.42 R4.1 36.36,28.8
  Bottom 0.305: 36.32,28.42 36.77,28.42 37.02,28.17 42.98,28.17 43.69,27.45 43.69,25.8 JP4.12
RS422_B  (via drill 0.38)
  Top 0.254: IC1.11 30.67,32.71 30.67,31.34 31.62,30.39 31.78,30.39 32.58,29.6 v32.74,29.6
  Bottom 0.254: 36.34,31.66 R4.2 | JP4.11 45.51,25.71 44.32,26.9 | 37.97,29.44 36.39,31.02 36.39,31.62 R4.2 | v32.74,29.6 32.74,28.8 32.89,28.64 34.64,28.64 35.12,29.12 35.12,30.48 R4.2
  Bottom 0.305: 44.32,26.9 44.32,27.53 43.21,28.64 38.77,28.64 37.97,29.44
RS422_RO
  Top 0.254: IC8.1 30.04,24.35 28.09,26.3 IC1.2
RS422_Y
  Top 0.254: 36.39,31.34 37.34,31.34 37.66,31.02 37.66,28.8 38.13,28.33 42.9,28.33 44.96,26.26 44.96,23.56 44.64,23.25 43.85,23.25 JP4.10
  Top 0.305: IC1.9 33.17,31.86 33.69,31.34 36.07,31.34 36.23,31.18
  Top 0.406: IC1.9 33.17,33.53 | 36.23,31.18 36.39,31.34 36.39,31.62 R5.1
RS422_Z
  Top 0.254: R5.2 36.96,28.86 37.97,27.85 42.1,27.85 42.58,27.37 42.58,22.29 43.05,21.82 46.07,21.82 46.39,22.13 46.39,23.1 JP4.9
  Top 0.305: 31.94,32.71 31.94,32.14 33.21,30.87 34.96,30.87 35.43,30.39 35.43,28.8 36.23,28.8 R5.2
  Top 0.406: R5.2 36.3,28.89 | 31.94,32.71 IC1.10
RS485_A  (via drill 0.38)
  Top 0.305: 38.93,12.29 38.61,12.29
  Top 0.406: JP7.1 35.96,7.21 36.7,7.21 38.61,9.12 38.61,11.97 38.93,12.29 39.88,12.29 40.12,12.54 R1.1 40.2,12.49 40.2,11.97 43.05,11.97 43.78,12.7 JP4.2 | 38.61,12.29 v38.29,12.61
  Bottom 0.305: IC2.A 37.83,12.15 v38.29,12.61
RS485_B  (via drill 0.38)
  Top 0.254: R2.1 35.11,12.62 35.43,12.29 35.43,11.97 35.43,11.5 v35.75,11.18
  Top 0.305: JP4.1 46.32,13.16 45.44,14.04 38.13,14.04 36.07,11.97 35.43,11.97
  Top 0.406: R2.1 29.04,12.62 R3.1
  Bottom 0.254: IC2.B 36.06,10.88 v35.75,11.18
RS485_BIASDOWN
  Top 0.406: R3.2 29.1,9.74 29.72,9.12 29.72,7.21 30.37,7.21 JP5.1
RS485_BIASUP
  Top 0.406: R1.2 40.02,9.74 39.4,9.12 39.4,7.64 JP6.1
RS485_RO  (via drill 0.38)
  Top 0.254: v30.04,18.32 IC8.6
  Top 0.406: IC8.6 30.04,19.91
  Bottom 0.254: v30.04,18.32 30.35,18.01 33.85,18.01 34.8,17.05 34.8,14.2 34.16,13.56 34.16,12.61 33.21,11.66 33.21,10.07 32.75,9.61 IC2.RO
RS485TERM
  Top 0.406: R2.2 34.55,9.82 33.85,9.12 33.85,7.64 JP7.2
RX_LED  (via drill 0.38)
  Top 0.254: RX.A 42.55,33.28 v41.15,34.52
  Bottom 0.254: IC6.4 41.35,34.21 arc45 41.27,34.39 v41.15,34.52
RX_LED2  (via drill 0.38)
  Top 0.254: RX.C 44.99,33.91 44.8,33.72 44.8,32.45 v44.64,32.29
  Bottom 0.254: R8.2 43.39,33.54 v44.64,32.29
TX_LED  (via drill 0.38)
  Top 0.254: TX.A 41.5,30.42 v41.15,30.39
  Bottom 0.254: IC6.6 41.35,30.59 v41.15,30.39
TX_LED2  (via drill 0.38)
  Top 0.254: TX.C 45.47,30.74 45.75,31.02 v45.75,32.29
  Bottom 0.254: v45.75,32.29 45.75,33.59 R10.2
UART_RX  (via drill 0.38)
  Top 0.254: v26.86,29.44 26.54,29.44 26.23,29.12 26.23,21.18 v26.54,20.86 26.54,20.84 27.62,19.76 28.15,19.76 IC8.4
  Bottom 0.1: 38.93,33.25 39.03,33.25 arc-45 IC6.3
  Bottom 0.254: U$1.4 26.52,20.89 v26.54,20.86 | v26.86,29.44 28.13,29.44 29.08,30.39 29.08,32.29 30.35,33.56 37.97,33.56 38.29,33.25 38.93,33.25
UART_TX  (via drill 0.38)
  Top 0.254: IC7.11 34.37,17.42 33.85,16.9 v28.77,16.9 | IC1.5 31.9,26.22 v31.94,26.26 30.35,26.26 30.04,26.58 30.04,29.44 v29.72,29.75
  Bottom 0.254: IC2.DI 32.17,13.4 29.56,13.4 28.77,14.2 v28.77,16.9 28.77,23.4 29.67,24.31 R9.1 30,24.32 v31.94,26.26 | v29.72,29.75 29.72,32.14 30.67,33.09 37.5,33.09 37.66,32.93 37.66,31.66 37.98,31.34 IC6.1
UART_TX_1
  Bottom 0.406: U$2.4 26.84,25.02 26.86,24.99 26.86,24.33 R9.2
USB_3V  (via drill 0.38)
  Top 0.254: IC9.10 IC9.11 20.78,18.75 | IC9.3 22.68,21.13
  Top 0.305: 22.73,25.94 v22.73,26.26 22.68,26.21 IC9.3 | 22.68,21.13 22.68,20.65 20.78,18.75
  Bottom 0.61: U5.6 17.34,28.13 C13.1 17.65,28.83 17.65,29.28 | U5.1 10.99,28.17 12.1,29.28 13.53,29.28 | U5.3 13.53,29.28 | 17.65,29.28 13.53,29.28 | 17.65,29.28 17.65,30.07 21.78,30.07 22.73,29.12 v22.73,26.26
USB_5V  (via drill 0.38)
  Top 0.254: IC9.12 21.41,17.16
  Top 0.305: 18.14,13.89 18.37,14.12 21.41,17.16
  Top 0.406: v9.24,13.56 v9.25,13.57 L1.2 17.82,13.57 18.37,14.12
  Bottom 0.406: D1.1 8.92,13.24 v9.24,13.56
USB_GND  (via drill 0.38)  (5 unrouted)
  Top 0.254: C11.1 10.86,23.91 10.99,24.04 12.62,24.04 C8.1
  Top 0.305: 12.93,24.52 C8.1 13.84,25.26 13.84,28.8 14.48,29.44 21.78,29.44 24.64,26.58 24.64,21.82 22.05,19.23 IC9.13 | IC9.5 21.41,24.41 20.99,24.83 18.92,24.83 18.92,24.52 v18.45,24.52
  Top 0.406: X1.4 5.08,23.21 5.43,23.56
  Top 0.61: C12.1 15.83,15.86 16.54,16.58 16.54,23.25 16.7,23.4
  Bottom 0.61: U5.8 19.88,28.8 | 19.88,28.8 19.88,29.12 | C13.2 20.04,28.64 19.88,28.8
  pour Top (isolate 0.254): 4.64,22.77 18.92,22.77 18.92,25.31 4.64,25.31
  pour Bottom (isolate 0.254): 20.51,25.63 10.03,25.63 10.67,23.72 21.15,23.72
  pour Top (isolate 0.254): 21.46,15.15 25.66,15.15 25.66,31.02 4.64,31.02 4.64,25.31 13.84,25.31 13.84,28.8 14.48,29.44 21.78,29.44 24.64,26.58 24.64,22.45 23.05,22.45 23.05,20.23 21.46,18.64
USB_RX
  Bottom 0.254: U5.12 16.07,18.96 17.34,20.23 21.15,20.23 22.42,18.96 22.95,18.96 U$1.1
USB_SWITCH
  Bottom 0.254: U5.14 13.53,15.78 14,15.31 17.5,15.31 17.97,15.78 17.97,18.96 18.29,19.28 20.83,19.28 20.99,19.12 20.99,17.37 21.15,17.21 24.8,17.21 25.27,17.69 25.27,18.98 U$1.6 | 24.64,18.98 U$1.6 | U$1.6 25.35,19.12 26.86,19.12 27.81,20.07 27.81,21.34 27.02,22.13 24.96,22.13 24.64,22.45 24.64,23.09 U$2.6
USB_TX
  Bottom 0.254: U5.13 14.8,16.1 15.11,15.78 16.38,15.78 16.7,16.1 16.7,18.64 17.81,19.75 20.99,19.75 21.46,19.28 21.46,18.01 21.78,17.69 23.85,17.69 24.16,18.01 24.16,21.42 U$2.1
USB_VCC
  Bottom 0.406: U1.1 7.87,8.08 C16.1 7.72,9.43 6.22,9.43 5.76,9.9 D1.3 5.82,12.36 D6.3
VCC_USB
  Top 0.406: X1.1 5.32,16.21 5.59,15.94 7.81,15.94 | 7.81,15.94 10.62,15.94 C12.2 | L1.1 7.85,15.9 7.81,15.94

### Text on the board
Top: Brain Slug
tStop: Brain Slug
bStop: github.com/mjbeals/BrainSlug
_tsilk: RS422 | RS232 | GND | PULL DOWN | TERM | PULL UP | B | A | EXTERNAL | VCC | +5V | RS485
_bsilk: 6 | RS422 B | RS422 A | 5 | RS422 Z | RS422 Y | 4 | Vcc +3 TO +16v | SIGNAL GND | 3 | Vss GND | SIGNAL GND | 2 | RS232 RX | RS232 TX | 1 | RS485 B | RS485 A | +5v | GND | TX | RX